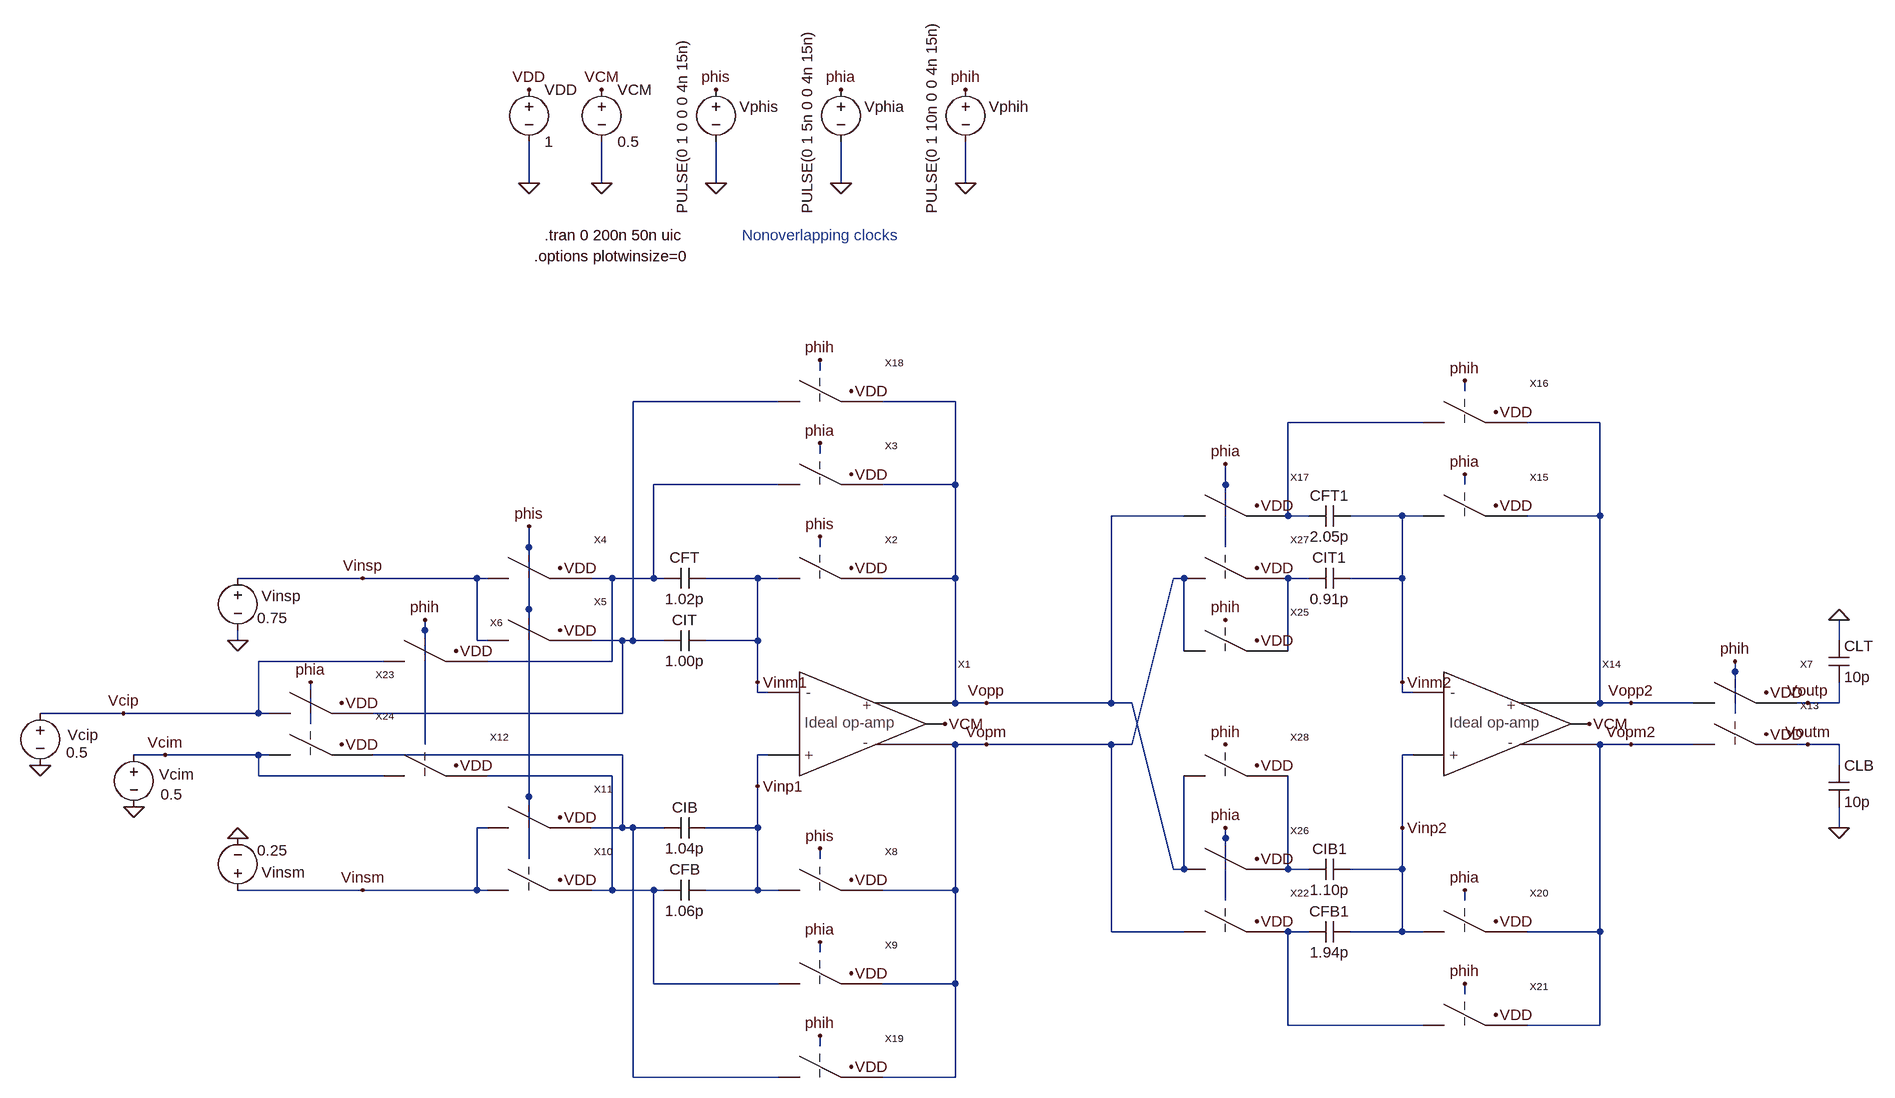
[diagram p0: schematic Fig30_60.asc]
Fig30_60.asc, the LTspice schematic file:
Version 4
SHEET 1 3696 696
WIRE 1312 -2624 1312 -2688
WIRE 1424 -2624 1424 -2688
WIRE 1600 -2624 1600 -2688
WIRE 1792 -2624 1792 -2688
WIRE 1984 -2624 1984 -2688
WIRE 1760 -2336 1760 -2352
WIRE 2752 -2304 2752 -2320
WIRE 1696 -2288 1472 -2288
WIRE 1968 -2288 1856 -2288
WIRE 2688 -2256 2480 -2256
WIRE 2960 -2256 2848 -2256
WIRE 1760 -2208 1760 -2224
WIRE 1696 -2160 1504 -2160
WIRE 1968 -2160 1968 -2288
WIRE 1968 -2160 1856 -2160
WIRE 2384 -2160 2384 -2192
WIRE 2752 -2160 2752 -2176
WIRE 2320 -2112 2208 -2112
WIRE 2480 -2112 2480 -2256
WIRE 2512 -2112 2480 -2112
WIRE 2656 -2112 2576 -2112
WIRE 2688 -2112 2656 -2112
WIRE 2960 -2112 2960 -2256
WIRE 2960 -2112 2848 -2112
WIRE 1312 -2064 1312 -2096
WIRE 1760 -2064 1760 -2080
WIRE 2384 -2064 2384 -2160
WIRE 1056 -2016 864 -2016
WIRE 1232 -2016 1056 -2016
WIRE 1248 -2016 1232 -2016
WIRE 1440 -2016 1408 -2016
WIRE 1504 -2016 1504 -2160
WIRE 1504 -2016 1440 -2016
WIRE 1520 -2016 1504 -2016
WIRE 1664 -2016 1584 -2016
WIRE 1696 -2016 1664 -2016
WIRE 1968 -2016 1968 -2160
WIRE 1968 -2016 1856 -2016
WIRE 2320 -2016 2304 -2016
WIRE 2512 -2016 2480 -2016
WIRE 2656 -2016 2656 -2112
WIRE 2656 -2016 2576 -2016
WIRE 1312 -1968 1312 -2064
WIRE 1152 -1936 1152 -1952
WIRE 864 -1920 864 -1936
WIRE 1232 -1920 1232 -2016
WIRE 1248 -1920 1232 -1920
WIRE 1456 -1920 1408 -1920
WIRE 1472 -1920 1472 -2288
WIRE 1472 -1920 1456 -1920
WIRE 1520 -1920 1472 -1920
WIRE 1664 -1920 1664 -2016
WIRE 1664 -1920 1584 -1920
WIRE 3328 -1920 3328 -1952
WIRE 2320 -1904 2320 -2016
WIRE 2480 -1904 2480 -2016
WIRE 1088 -1888 896 -1888
WIRE 1440 -1888 1440 -2016
WIRE 1440 -1888 1248 -1888
WIRE 3168 -1872 3168 -1888
WIRE 1664 -1856 1664 -1920
WIRE 2656 -1856 2656 -2016
WIRE 1664 -1840 1664 -1856
WIRE 1680 -1840 1664 -1840
WIRE 2656 -1840 2656 -1856
WIRE 2672 -1840 2656 -1840
WIRE 1968 -1824 1968 -2016
WIRE 2016 -1824 1968 -1824
WIRE 2208 -1824 2208 -2112
WIRE 2208 -1824 2016 -1824
WIRE 2240 -1824 2208 -1824
WIRE 2960 -1824 2960 -2112
WIRE 3008 -1824 2960 -1824
WIRE 3104 -1824 3008 -1824
WIRE 3280 -1824 3264 -1824
WIRE 3328 -1824 3328 -1856
WIRE 3328 -1824 3280 -1824
WIRE 688 -1808 560 -1808
WIRE 896 -1808 896 -1888
WIRE 896 -1808 688 -1808
WIRE 912 -1808 896 -1808
WIRE 1456 -1808 1456 -1920
WIRE 1456 -1808 1072 -1808
WIRE 3168 -1808 3168 -1872
WIRE 976 -1792 976 -1856
WIRE 1152 -1760 1152 -1936
WIRE 2016 -1760 1968 -1760
WIRE 2208 -1760 2016 -1760
WIRE 2240 -1760 2304 -2016
WIRE 2240 -1760 2208 -1760
WIRE 3008 -1760 2960 -1760
WIRE 3104 -1760 3008 -1760
WIRE 3280 -1760 3264 -1760
WIRE 3328 -1760 3280 -1760
WIRE 752 -1744 704 -1744
WIRE 896 -1744 752 -1744
WIRE 912 -1744 896 -1744
WIRE 1456 -1744 1072 -1744
WIRE 1680 -1744 1664 -1744
WIRE 2672 -1744 2656 -1744
WIRE 3328 -1728 3328 -1760
WIRE 896 -1712 896 -1744
WIRE 1088 -1712 896 -1712
WIRE 1440 -1712 1248 -1712
WIRE 1664 -1696 1664 -1744
WIRE 1312 -1680 1312 -1968
WIRE 1248 -1632 1232 -1632
WIRE 1456 -1632 1456 -1744
WIRE 1456 -1632 1408 -1632
WIRE 1472 -1632 1456 -1632
WIRE 1520 -1632 1472 -1632
WIRE 1664 -1632 1664 -1696
WIRE 1664 -1632 1584 -1632
WIRE 2656 -1632 2656 -1744
WIRE 3328 -1632 3328 -1664
WIRE 2384 -1616 2384 -1632
WIRE 1312 -1584 1312 -1680
WIRE 1760 -1584 1760 -1600
WIRE 2304 -1568 2240 -1824
WIRE 2320 -1568 2320 -1712
WIRE 2320 -1568 2304 -1568
WIRE 2480 -1568 2480 -1712
WIRE 2512 -1568 2480 -1568
WIRE 2656 -1568 2656 -1632
WIRE 2656 -1568 2576 -1568
WIRE 1056 -1536 864 -1536
WIRE 1232 -1536 1232 -1632
WIRE 1232 -1536 1056 -1536
WIRE 1248 -1536 1232 -1536
WIRE 1440 -1536 1440 -1712
WIRE 1440 -1536 1408 -1536
WIRE 1504 -1536 1440 -1536
WIRE 1520 -1536 1504 -1536
WIRE 1664 -1536 1664 -1632
WIRE 1664 -1536 1584 -1536
WIRE 1696 -1536 1664 -1536
WIRE 1968 -1536 1968 -1760
WIRE 1968 -1536 1856 -1536
WIRE 2384 -1520 2384 -1616
WIRE 2752 -1520 2752 -1536
WIRE 2208 -1472 2208 -1760
WIRE 2320 -1472 2208 -1472
WIRE 2512 -1472 2480 -1472
WIRE 2656 -1472 2656 -1568
WIRE 2656 -1472 2576 -1472
WIRE 2688 -1472 2656 -1472
WIRE 2960 -1472 2960 -1760
WIRE 2960 -1472 2848 -1472
WIRE 1760 -1440 1760 -1456
WIRE 1504 -1392 1504 -1536
WIRE 1696 -1392 1504 -1392
WIRE 1968 -1392 1968 -1536
WIRE 1968 -1392 1856 -1392
WIRE 2752 -1376 2752 -1392
WIRE 2480 -1328 2480 -1472
WIRE 2688 -1328 2480 -1328
WIRE 2960 -1328 2960 -1472
WIRE 2960 -1328 2848 -1328
WIRE 1760 -1296 1760 -1312
WIRE 1472 -1248 1472 -1632
WIRE 1696 -1248 1472 -1248
WIRE 1968 -1248 1968 -1392
WIRE 1968 -1248 1856 -1248
FLAG 1600 -2624 0
FLAG 1600 -2768 phis
FLAG 1312 -2624 0
FLAG 1312 -2768 VDD
FLAG 1792 -2624 0
FLAG 1792 -2768 phia
FLAG 1424 -2624 0
FLAG 1424 -2768 VCM
FLAG 1984 -2624 0
FLAG 1984 -2768 phih
FLAG 1808 -2176 VDD
FLAG 1808 -2032 VDD
FLAG 1760 -2224 phia
FLAG 1760 -2080 phis
FLAG 1360 -1936 VDD
FLAG 1360 -2032 VDD
FLAG 1312 -2096 phis
FLAG 1152 -1952 phih
FLAG 1056 -2016 Vinsp
FLAG 1952 -1792 VCM
FLAG 2016 -1824 Vopp
FLAG 1200 -1904 VDD
FLAG 3216 -1840 VDD
FLAG 3168 -1888 phih
FLAG 3328 -1952 0
FLAG 864 -1920 0
FLAG 1808 -1408 VDD
FLAG 1808 -1552 VDD
FLAG 1760 -1456 phia
FLAG 1760 -1600 phis
FLAG 1360 -1648 VDD
FLAG 1360 -1552 VDD
FLAG 1056 -1536 Vinsm
FLAG 2016 -1760 Vopm
FLAG 1200 -1728 VDD
FLAG 3216 -1776 VDD
FLAG 3328 -1632 0
FLAG 864 -1616 0
FLAG 3280 -1760 Voutm
FLAG 3280 -1824 Voutp
FLAG 1664 -1856 Vinm1
FLAG 1664 -1696 Vinp1
FLAG 560 -1728 0
FLAG 704 -1664 0
FLAG 688 -1808 Vcip
FLAG 752 -1744 Vcim
FLAG 2800 -2272 VDD
FLAG 2800 -2128 VDD
FLAG 2752 -2320 phih
FLAG 2752 -2176 phia
FLAG 2432 -2128 VDD
FLAG 2944 -1792 VCM
FLAG 3008 -1824 Vopp2
FLAG 2800 -1344 VDD
FLAG 2800 -1488 VDD
FLAG 2752 -1392 phih
FLAG 2752 -1536 phia
FLAG 2432 -1488 VDD
FLAG 3008 -1760 Vopm2
FLAG 2656 -1856 Vinm2
FLAG 2656 -1632 Vinp2
FLAG 2384 -2192 phia
FLAG 2384 -1632 phia
FLAG 1808 -2304 VDD
FLAG 1760 -2352 phih
FLAG 1808 -1264 VDD
FLAG 1760 -1312 phih
FLAG 1024 -1824 VDD
FLAG 1024 -1760 VDD
FLAG 976 -1856 phia
FLAG 2432 -1920 VDD
FLAG 2384 -1952 phih
FLAG 2432 -1584 VDD
FLAG 2432 -2032 VDD
FLAG 2432 -1728 VDD
FLAG 2384 -1760 phih
SYMBOL Ideal_differential_op_amp 1728 -1792 R0
SYMATTR InstName X1
SYMBOL voltage 1600 -2784 R0
WINDOW 0 36 42 Left 0
WINDOW 3 -52 207 VLeft 0
WINDOW 123 0 0 Left 0
WINDOW 39 0 0 Left 0
SYMATTR InstName Vphis
SYMATTR Value PULSE(0 1 0 0 0 4n 15n)
SYMBOL voltage 1312 -2784 R0
WINDOW 123 0 0 Left 0
WINDOW 39 0 0 Left 0
SYMATTR InstName VDD
SYMATTR Value 1
SYMBOL voltage 1792 -2784 R0
WINDOW 0 36 42 Left 0
WINDOW 3 -52 207 VLeft 0
WINDOW 123 0 0 Left 0
WINDOW 39 0 0 Left 0
SYMATTR InstName Vphia
SYMATTR Value PULSE(0 1 5n 0 0 4n 15n)
SYMBOL voltage 1424 -2784 R0
WINDOW 123 0 0 Left 0
WINDOW 39 0 0 Left 0
SYMATTR InstName VCM
SYMATTR Value 0.5
SYMBOL voltage 1984 -2784 R0
WINDOW 0 36 42 Left 0
WINDOW 3 -52 207 VLeft 0
WINDOW 123 0 0 Left 0
WINDOW 39 0 0 Left 0
SYMATTR InstName Vphih
SYMATTR Value PULSE(0 1 10n 0 0 4n 15n)
SYMBOL switch_1 1696 -2000 R0
SYMATTR InstName X2
SYMBOL switch_1 1696 -2144 R0
SYMATTR InstName X3
SYMBOL cap 1520 -1904 R270
WINDOW 0 32 32 VTop 0
WINDOW 3 0 32 VBottom 0
SYMATTR InstName CIT
SYMATTR Value 1.00p
SYMBOL cap 1520 -2000 R270
WINDOW 0 32 32 VTop 0
WINDOW 3 0 32 VBottom 0
SYMATTR InstName CFT
SYMATTR Value 1.02p
SYMBOL switch_1 1248 -2000 R0
SYMATTR InstName X4
SYMBOL switch_1 1248 -1904 R0
SYMATTR InstName X5
SYMBOL switch_1 1088 -1872 R0
SYMATTR InstName X6
SYMBOL switch_1 3104 -1808 R0
SYMATTR InstName X7
SYMBOL cap 3312 -1920 R0
SYMATTR InstName CLT
SYMATTR Value 10p
SYMBOL voltage 864 -2032 R0
WINDOW 0 37 43 Left 0
WINDOW 3 30 77 Left 0
WINDOW 123 0 0 Left 0
WINDOW 39 0 0 Left 0
SYMATTR InstName Vinsp
SYMATTR Value 0.75
SYMBOL switch_1 1696 -1520 R0
SYMATTR InstName X8
SYMBOL switch_1 1696 -1376 R0
SYMATTR InstName X9
SYMBOL cap 1520 -1648 M90
WINDOW 0 0 32 VBottom 0
WINDOW 3 32 32 VTop 0
SYMATTR InstName CIB
SYMATTR Value 1.04p
SYMBOL cap 1520 -1552 M90
WINDOW 0 0 32 VBottom 0
WINDOW 3 32 32 VTop 0
SYMATTR InstName CFB
SYMATTR Value 1.06p
SYMBOL switch_1 1248 -1520 R0
SYMATTR InstName X10
SYMBOL switch_1 1248 -1616 R0
SYMATTR InstName X11
SYMBOL switch_1 1088 -1696 R0
SYMATTR InstName X12
SYMBOL switch_1 3104 -1744 R0
SYMATTR InstName X13
SYMBOL cap 3312 -1664 M180
WINDOW 0 24 64 Left 0
WINDOW 3 24 8 Left 0
SYMATTR InstName CLB
SYMATTR Value 10p
SYMBOL voltage 864 -1520 M180
WINDOW 0 37 43 Left 0
WINDOW 3 30 77 Left 0
WINDOW 123 0 0 Left 0
WINDOW 39 0 0 Left 0
SYMATTR InstName Vinsm
SYMATTR Value 0.25
SYMBOL voltage 560 -1824 R0
WINDOW 0 42 49 Left 0
WINDOW 3 40 76 Left 0
WINDOW 123 0 0 Left 0
WINDOW 39 0 0 Left 0
SYMATTR InstName Vcip
SYMATTR Value 0.5
SYMBOL voltage 704 -1760 R0
WINDOW 0 39 46 Left 0
WINDOW 3 41 77 Left 0
WINDOW 123 0 0 Left 0
WINDOW 39 0 0 Left 0
SYMATTR InstName Vcim
SYMATTR Value 0.5
SYMBOL Ideal_differential_op_amp 2720 -1792 R0
SYMATTR InstName X14
SYMBOL switch_1 2688 -2096 R0
SYMATTR InstName X15
SYMBOL switch_1 2688 -2240 R0
SYMATTR InstName X16
SYMBOL cap 2512 -2000 R270
WINDOW 0 32 32 VTop 0
WINDOW 3 0 32 VBottom 0
SYMATTR InstName CIT1
SYMATTR Value 0.91p
SYMBOL cap 2512 -2096 R270
WINDOW 0 32 32 VTop 0
WINDOW 3 0 32 VBottom 0
SYMATTR InstName CFT1
SYMATTR Value 2.05p
SYMBOL switch_1 2320 -2096 R0
SYMATTR InstName X17
SYMBOL switch_1 2688 -1456 R0
SYMATTR InstName X20
SYMBOL switch_1 2688 -1312 R0
SYMATTR InstName X21
SYMBOL cap 2512 -1584 M90
WINDOW 0 0 32 VBottom 0
WINDOW 3 32 32 VTop 0
SYMATTR InstName CIB1
SYMATTR Value 1.10p
SYMBOL cap 2512 -1488 M90
WINDOW 0 0 32 VBottom 0
WINDOW 3 32 32 VTop 0
SYMATTR InstName CFB1
SYMATTR Value 1.94p
SYMBOL switch_1 2320 -1456 R0
SYMATTR InstName X22
SYMBOL switch_1 1696 -2272 R0
SYMATTR InstName X18
SYMBOL switch_1 1696 -1232 R0
SYMATTR InstName X19
SYMBOL switch_1 912 -1792 R0
SYMATTR InstName X23
SYMBOL switch_1 912 -1728 R0
SYMATTR InstName X24
SYMBOL switch_1 2320 -1888 R0
SYMATTR InstName X25
SYMBOL switch_1 2320 -1552 R0
SYMATTR InstName X26
SYMBOL switch_1 2320 -2000 R0
SYMATTR InstName X27
SYMBOL switch_1 2320 -1696 R0
SYMATTR InstName X28
TEXT 1336 -2544 Left 0 !.tran 0 200n 50n uic
TEXT 1640 -2544 Left 0 ;Nonoverlapping clocks
TEXT 1320 -2512 Left 0 !.options plotwinsize=0

The netlist it stands for:
* Fig30_60.asc
XX1 Vinm1 Vinp1 Vopp VCM Vopm Ideal_differential_op_amp  ; pins Vinm Vinp Outp VCM Outm
Vphis phis 0 PULSE(0 1 0 0 0 4n 15n)
VDD VDD 0 1
Vphia phia 0 PULSE(0 1 5n 0 0 4n 15n)
VCM VCM 0 0.5
Vphih phih 0 PULSE(0 1 10n 0 0 4n 15n)
XX2 Vinm1 Vopp phis VDD switch_1  ; pins P1 P2 clk VDD
XX3 N003 Vopp phia VDD switch_1  ; pins P1 P2 clk VDD
CIT N001 Vinm1 1.00p
CFT N003 Vinm1 1.02p
XX4 Vinsp N003 phis VDD switch_1  ; pins P1 P2 clk VDD
XX5 Vinsp N001 phis VDD switch_1  ; pins P1 P2 clk VDD
XX6 Vcip N003 phih VDD switch_1  ; pins P1 P2 clk VDD
XX7 Vopp2 Voutp phih VDD switch_1  ; pins P1 P2 clk VDD
CLT 0 Voutp 10p
Vinsp Vinsp 0 0.75
XX8 Vinp1 Vopm phis VDD switch_1  ; pins P1 P2 clk VDD
XX9 N006 Vopm phia VDD switch_1  ; pins P1 P2 clk VDD
CIB N005 Vinp1 1.04p
CFB N006 Vinp1 1.06p
XX10 Vinsm N006 phis VDD switch_1  ; pins P1 P2 clk VDD
XX11 Vinsm N005 phis VDD switch_1  ; pins P1 P2 clk VDD
XX12 Vcim N006 phih VDD switch_1  ; pins P1 P2 clk VDD
XX13 Vopm2 Voutm phih VDD switch_1  ; pins P1 P2 clk VDD
CLB 0 Voutm 10p
Vinsm Vinsm 0 0.25
Vcip Vcip 0 0.5
Vcim Vcim 0 0.5
XX14 Vinm2 Vinp2 Vopp2 VCM Vopm2 Ideal_differential_op_amp  ; pins Vinm Vinp Outp VCM Outm
XX15 Vinm2 Vopp2 phia VDD switch_1  ; pins P1 P2 clk VDD
XX16 N002 Vopp2 phih VDD switch_1  ; pins P1 P2 clk VDD
CIT1 N004 Vinm2 0.91p
CFT1 N002 Vinm2 2.05p
XX17 Vopp N002 phia VDD switch_1  ; pins P1 P2 clk VDD
XX20 Vinp2 Vopm2 phia VDD switch_1  ; pins P1 P2 clk VDD
XX21 N008 Vopm2 phih VDD switch_1  ; pins P1 P2 clk VDD
CIB1 N007 Vinp2 1.10p
CFB1 N008 Vinp2 1.94p
XX22 Vopm N008 phia VDD switch_1  ; pins P1 P2 clk VDD
XX18 N001 Vopp phih VDD switch_1  ; pins P1 P2 clk VDD
XX19 N005 Vopm phih VDD switch_1  ; pins P1 P2 clk VDD
XX23 Vcip N001 phia VDD switch_1  ; pins P1 P2 clk VDD
XX24 Vcim N005 phia VDD switch_1  ; pins P1 P2 clk VDD
XX25 Vopm N004 phih VDD switch_1  ; pins P1 P2 clk VDD
XX26 Vopp N007 phia VDD switch_1  ; pins P1 P2 clk VDD
XX27 Vopm N004 phia VDD switch_1  ; pins P1 P2 clk VDD
XX28 Vopp N007 phih VDD switch_1  ; pins P1 P2 clk VDD
.tran 0 200n 50n uic
* Nonoverlapping clocks
.options plotwinsize=0
.backanno
.end